# Altium schematic sheet fillcap_top.SchDoc: Top
size A3; DrawnBy: daniw / ninux; Organization: HSLU T&A; Address1: Abteilung Elektrotechnik; Address2: Technikumsstrasse 21; Address3: CH-6048 Horw; SheetNumber: 1; SheetTotal: 9; Projektname: fillcap
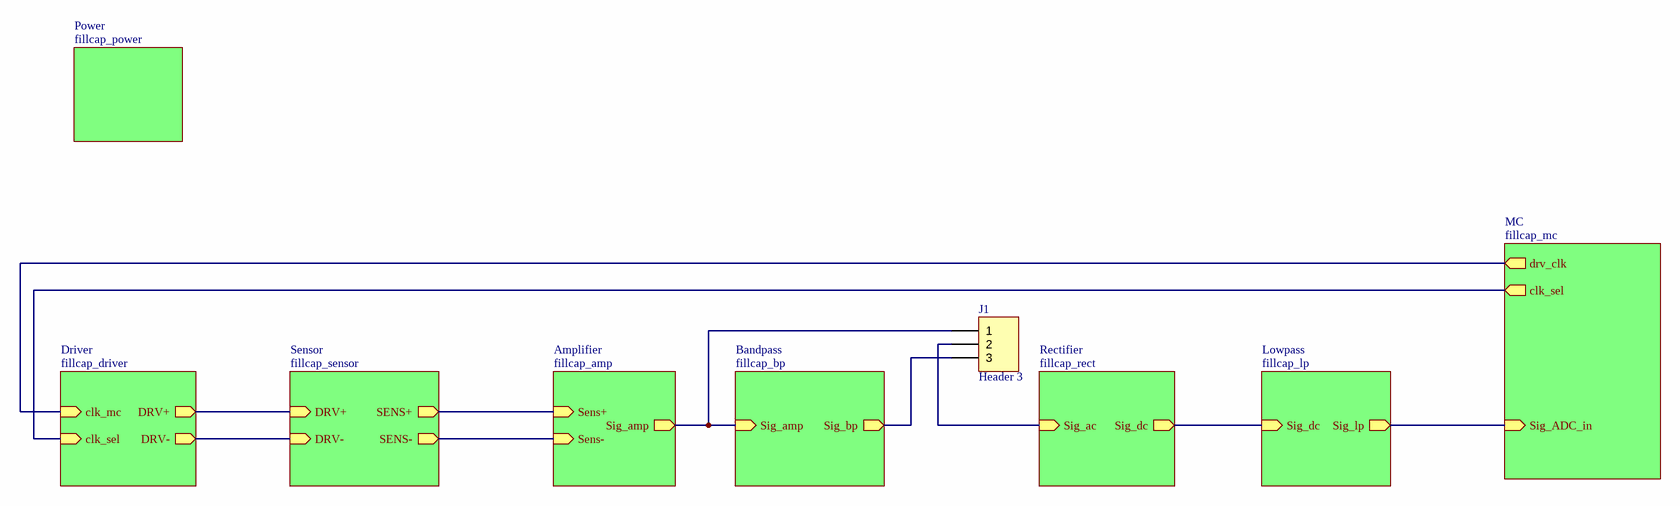
[diagram p0: fillcap_top.SchDoc]

## Parts
J1  Header 3  [HDR1X3]

## Sub-sheets
Amplifier = fillcap_amp: Sens+ (in), Sens- (in), Sig_amp (out)
Bandpass = fillcap_bp: Sig_amp (in), Sig_bp (out)
Driver = fillcap_driver: DRV+ (out), DRV- (out), clk_mc (in), clk_sel (in)
Lowpass = fillcap_lp: Sig_dc (in), Sig_lp (out)
MC = fillcap_mc: Sig_ADC_in (in), drv_clk (out), clk_sel (out)
Power = fillcap_power: no entries
Rectifier = fillcap_rect: Sig_ac (in), Sig_dc (out)
Sensor = fillcap_sensor: DRV+ (in), DRV- (in), SENS+ (out), SENS- (out)

## Nets
NetJ1_1: J1.1 ; sheet Amplifier/Sig_amp, sheet Bandpass/Sig_amp
NetJ1_2: J1.2 ; sheet Rectifier/Sig_ac
NetJ1_3: J1.3 ; sheet Bandpass/Sig_bp
(unnamed): sheet Driver/DRV+, sheet Sensor/DRV+
(unnamed): sheet Driver/DRV-, sheet Sensor/DRV-
(unnamed): sheet Driver/clk_mc, sheet MC/drv_clk
(unnamed): sheet Driver/clk_sel, sheet MC/clk_sel
(unnamed): sheet Sensor/SENS+, sheet Amplifier/Sens+
(unnamed): sheet Sensor/SENS-, sheet Amplifier/Sens-
(unnamed): sheet Rectifier/Sig_dc, sheet Lowpass/Sig_dc
(unnamed): sheet Lowpass/Sig_lp, sheet MC/Sig_ADC_in

## Notes on the sheet
- Project:
- Drawn by:
- Size:
- Sheet
- A3
- Rev.:
- of
- Date:
- File:

## Library data of the parts
J1 = Header 3: Header, 3-Pin; LatestRevisionDate: 17-Jul-2002; LatestRevisionNote: Re-released for DXP Platform.; Publisher: Altium Limited